# EasyEDA Pro project ProProject_底板_V1_2024-08-05.epro

# Schematic Schematic1
Create Date: 2024-07-20; Page Name: P1; Project Name: 底板_V1; Schematic Name: Schematic1; Update Date: 2024-07-25; Company: 嘉立创EDA; Page Size: A4; Version: V1.0
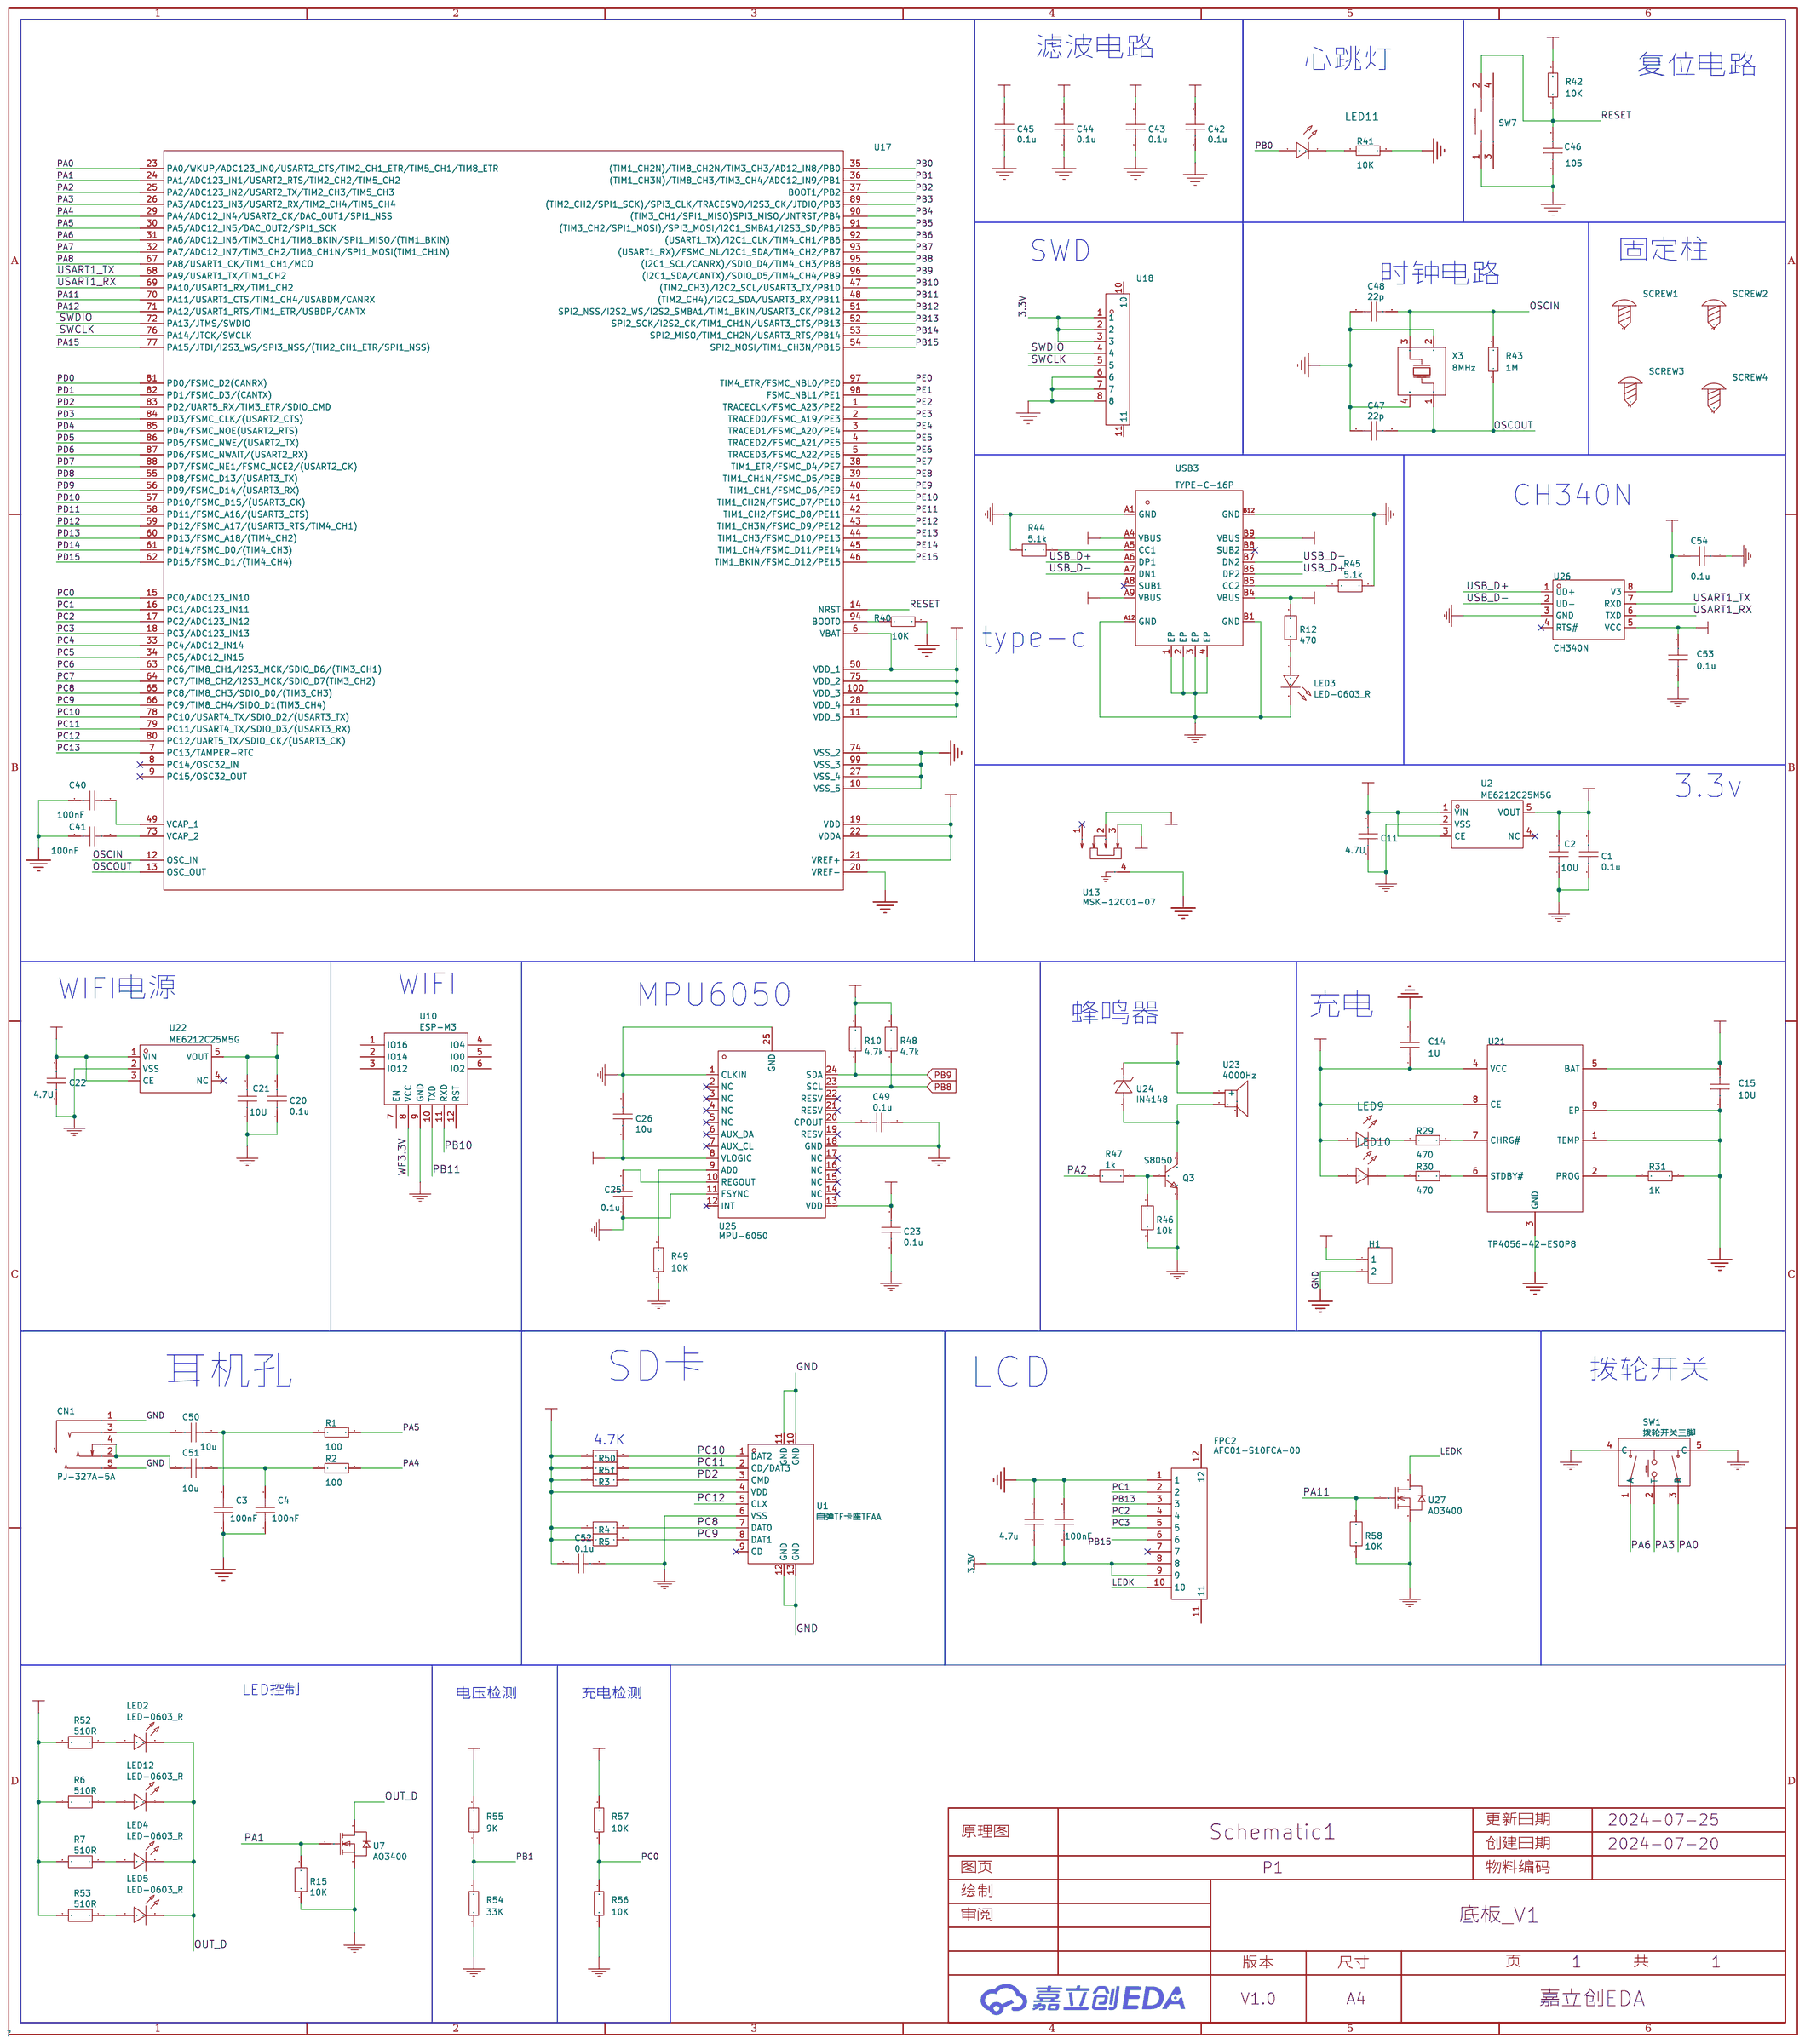
[diagram p0: schematic sheet]

## Parts
C1  0.1u  [footprint_d063]
C2  10U  [footprint_d063]
C3  100nF  [C0603]
C4  100nF  [C0603]
C11  4.7U  [footprint_d063]
C14  1U  [C0603]
C15  10U  [C0603]
C20  0.1u  [footprint_d063]
C21  10U  [footprint_d063]
C22  4.7U  [footprint_d063]
C23  0.1u  [footprint_d063]
C25  0.1u  [footprint_d063]
C26  10u  [footprint_d063]
C40  100nF  [C0603]
C41  100nF  [C0603]
C42  0.1u  [footprint_88df]
C43  0.1u  [footprint_88df]
C44  0.1u  [footprint_88df]
C45  0.1u  [footprint_88df]
C46  105  [footprint_88df]
C47  22p  [footprint_88df]
C48  22p  [footprint_88df]
C49  0.1u  [footprint_d063]
C50  10u  [C0603]
C51  10u  [C0603]
C52  0.1u  [C0603]
C53  0.1u  [footprint_d063]
C54  0.1u  [footprint_d063]
C57  100nF  [C0603]
C58  4.7u  [C0603]
CN1  PJ-327A-5A  [AUDIO-SMD_PJ-327A-5A]
FPC2  AFC01-S10FCA-00  [FPC-SMD_P0.5-10P_FGS-XJ-H2.0]
H1  -  [HDR-TH_2P-P2.54-V-F]
LED2  LED-0603_R  [footprint_5b50]
LED3  LED-0603_R  [footprint_1210]
LED4  LED-0603_R  [footprint_5b50]
LED5  LED-0603_R  [footprint_5b50]
LED9  -  [LED_0603]
LED10  -  [LED_0603]
LED11  -  [LED_0603]
LED12  LED-0603_R  [footprint_5b50]
Q3  S8050  [footprint_2907]
R1  100  [R0603]
R2  100  [R0603]
R3  1k  [R0805]
R4  1k  [R0805]
R5  1k  [R0805]
R6  510R  [footprint_4dfc]
R7  510R  [footprint_4dfc]
R10  4.7k  [footprint_1dde]
R12  470  [footprint_1dde]
R15  10K  [footprint_4dfc]
R29  470  [R0805]
R30  470  [R0805]
R31  1K  [R0805]
R40  10K  [R0603]
R41  10K  [R0603]
R42  10K  [R0603]
R43  1M  [R0603]
R44  5.1k  [footprint_1dde]
R45  5.1k  [footprint_1dde]
R46  10k  [footprint_b185]
R47  1k  [footprint_b185]
R48  4.7k  [footprint_1dde]
R49  10K  [R0603]
R50  1k  [R0805]
R51  1k  [R0805]
R52  510R  [footprint_4dfc]
R53  510R  [footprint_4dfc]
R54  33K  [R0805]
R55  9K  [R0805]
R56  10K  [R0805]
R57  10K  [R0805]
R58  10K  [footprint_4dfc]
SCREW1  -  [M3螺丝]
SCREW2  -  [M3螺丝]
SCREW3  -  [M3螺丝]
SCREW4  -  [M3螺丝]
SW1  拨轮开关三脚  [footprint_864c]
SW7  K2-1806SA-C4DW-04  [footprint_8ca7]
U1  自弹TF卡座TFAA  [SIM-SMD_C9900015645]
U2  ME6212C25M5G  [footprint_203e]
U7  AO3400  [footprint_8e82]
U10  ESP-M3  [footprint_c8ca]
U13  MSK-12C01-07  [SW-SMD_MSK12CO2-BDM]
U17  -  [LQFP-100_L14.0-W14.0-P0.50-LS16.0-BL]
U18  SMTFPC连接器0.5MM间距翻盖8PIN  [FPC-SMD_AFC01-S08FCC-00]
U21  TP4056-42-ESOP8  [ESOP-8_L4.9-W3.9-P1.27-LS6.0-BL-EP]
U22  ME6212C25M5G  [footprint_203e]
U23  4000Hz  [footprint_ea09]
U24  IN4148  [footprint_0926]
U25  MPU-6050  [QFN-24_L4.0-W4.0-P0.50-BL-EP2.7]
U26  CH340N  [SOP-8_L4.9-W3.9-P1.27-LS6.0-BL]
U27  AO3400  [footprint_8e82]
USB3  TYPE-C-16P  [footprint_feef]
X3  8MHz  [OSC-SMD_4P-L3.2-W2.5-BL]

## Library data of the parts
C1 C20 C23 C25 C49 C52-C54 = 0.1u
C2 C21 = 10U
C3 C4 C14 C15 C40 C41 C50 C51 C57 C58 = CAP_0603: Supplier Footprint: 0603
C11 C22 = 4.7U
C26 = 10u
C42-C45 = 1u
C46 = 105
C47 C48 = 22p
CN1 = PJ-327A-5A_C707227: 连接器类型:3.5mm耳机座;额定电流:500mA;额定电压:30V;工作温度范围:-40℃~+80℃;; LCSC Part Name: 3.5mm耳机座; Supplier Part: C707227; Manufacturer: 韩国韩荣; Supplier Footprint: SMD; JLCPCB Part Class: 扩展库; Datasheet: https://atta.szlcsc.com/upload/public/pdf/source/20200721/C707227_9267E4556273F941C560011EDEE7F466.pdf; Supplier: LCSC; Connector Type: 3.5mm耳机座; Current Rating (Max): 500mA; Voltage Rating (Max): 30V; Operating Temperature Range: -40℃~+80℃
FPC2 = AFC01-S10FCA-00: 锁定特性:翻盖式;触点类型:下接;触点数量:10P;间距:0.5mm;安装类型:卧贴;; LCSC Part Name: 间距:0.5mm P数:10P 翻盖式 下接; Supplier Part: C262659; Manufacturer: JS(钜硕电子); Supplier Footprint: SMD,P=0.5mm,卧贴; JLCPCB Part Class: 扩展库; Datasheet: https://atta.szlcsc.com/upload/public/pdf/source/20190816/C413942_2A72D1AC756EAE17EEDF756A339D4500.pdf; Supplier: LCSC; Locking Feature: 翻盖式; Contact Type: 下接; Number of Contacts: 10P; Pitch: 0.5mm; Mounting Type: 卧贴; FFC, FCB Thickness: 0.3mm; Height Above Board: 2mm
H1 = HDR-F_2.54_1x2P: Supplier Part: C49661; Supplier Footprint: 插件
LED2-LED5 LED12 = LED-0603_R: Manufacturer: EVERLIGHT(台湾亿光); Manufacturer Part: 19-217/R6C-AL1M2VY/3T; Supplier Part: C72044; Supplier: LCSC
LED9-LED11 = LED_0603-R: Supplier Footprint: 0603
Q3 = S8050: Supplier: LCSC; Supplier Part: C2984677; Manufacturer: 集晶电子; JLCPCB Part Class: Extended Part; link: https://so.szlcsc.com/global.html?k=C2984677&amp;ref=editor
R1 R2 R40-R43 R49 = Res_0603: Supplier Footprint: 0603
R3-R5 R47 R50 R51 = 1k
R6 R7 R52 R53 = 510R
R10 R48 = 4.7k
R12 = 470
R15 R58 = 10K
R29-R31 R54-R57 = Res_0805: Supplier Footprint: 0805
R44 R45 = 5.1k
R46 = 00k
SCREW1-SCREW4 = M3螺丝: Supplier Footprint: 插件
SW1 = 拨轮开关三脚
SW7 = K2-1806SA-C4DW-04: Supplier: LCSC; Supplier Part: C961746; Manufacturer: 韩国韩荣; JLCPCB Part Class: Extended Part
U1 = 自弹TF卡座TFAA: Supplier: LCSC; Supplier Part: C9900015645; Manufacturer: null; link: https://atta.szlcsc.comnull; JLCPCB Part Class: Extended Part
U2 U22 = ME6212C25M5G: Supplier: LCSC; Supplier Part: C2911282; Manufacturer: MICRONE(南京微盟); JLCPCB Part Class: Extended Part; link: https://so.szlcsc.com/global.html?k=C2911282&amp;ref=editor
U7 U27 = AO3400: Supplier: LCSC; Supplier Part: C5224189; Manufacturer: ElecSuper(静芯微）; JLCPCB Part Class: Extended Part; link: https://so.szlcsc.com/global.html?k=C5224189&amp;ref=editor
U10 = ESP-M3
U13 = MSK-12C01-07: Supplier: LCSC; Supplier Part: C9900005167; Manufacturer: null; JLCPCB Part Class: Extended Part
U17 = STM32F407VET6: tags: STM32; Supplier Part: C28730; Supplier: LCSC; Manufacturer: ST; image: http://image.lceda.cn/szlcsc/C28730.jpg; JLCPCB Part Class: Basic
U18 = SMTFPC连接器0.5MM间距翻盖8PIN: Supplier Part: C9900001730; JLCPCB Part Class: Extended Part; Datasheet: 2021-11-11/570927A/0f6bb2f581574a4697c3d67af550caf2/10301099.pdf; Supplier: LCSC
U21 = TP4056: 充电电池的类型:-;电池单元组数:-;最大充电电流:-;充满的电池组电压:-;最大供应电压:-;; Supplier Part: C16581; Manufacturer: TOPPOWER(南京拓微); Supplier Footprint: ESOP-8; JLCPCB Part Class: Basic Part; Datasheet: https://atta.szlcsc.com/upload/public/pdf/source/20190626/C16581_611BCF5D7CF554EAE465137A8F68DB3E.pdf; Supplier: LCSC
U23 = 4000Hz: Supplier: LCSC; Supplier Part: C781883; Manufacturer: YUEXIN(悦馨); Manufacturer Part: YX-SMD5020; JLCPCB Part Class: Extended Part
U24 = IN4148: Supplier: LCSC; Supplier Part: C9900004332; Manufacturer: null; Manufacturer Part: IN4148贴片二极管; JLCPCB Part Class: Extended Part; link: https://so.szlcsc.com/global.html?k=C9900004332&amp;ref=editor
U25 = MPU-6050_C24112: 三轴加速度计和三轴陀螺仪，工作电压：2.375V~3.46V; Supplier Part: C24112; Manufacturer: TDK InvenSense(应美盛); Supplier Footprint: QFN-24(4x4); JLCPCB Part Class: Basic Part; Datasheet: https://atta.szlcsc.com/upload/public/pdf/source/20140425/1457707046159.pdf; Supplier: LCSC
U26 = CH340N: LCSC Part Name: USB转串口芯片 CH340; Supplier Part: C2977777; Manufacturer: WCH(南京沁恒); Supplier Footprint: SOP-8; JLCPCB Part Class: 扩展库; Datasheet: https://atta.szlcsc.com/upload/public/pdf/source/20230530/6E401E9554E9F5311886CC8B3F89B62E.pdf; Supplier: LCSC
USB3 = TYPE-C-16P: Supplier: LCSC; Supplier Part: C709357; Manufacturer: Shenzhen Kinghelm Elec; Manufacturer Part: KH-TYPE-C-16P; JLCPCB Part Class: Extended Part
X3 = X322525MOB4SI: 晶振类型:贴片无源晶振;频率:25MHz;频率公差:±10ppm;频率稳定度:±30ppm;负载电容:12pF;工作温度:-40℃~+85℃;; LCSC Part Name: 25MHz ±10ppm 12pF; Supplier Part: C9006; Manufacturer: YXC(扬兴晶振); Supplier Footprint: SMD3225-4P; JLCPCB Part Class: Basic Part; Datasheet: https://atta.szlcsc.com/upload/public/pdf/source/20210329/C112971_1F611BDC486E193C1706F6D8EB5AA189.pdf; Supplier: LCSC; Crystal Type: 贴片无源晶振; Frequency Tolerance: ±10ppm; Frequency Stability: ±30ppm; Load Capacitance: 12pF; Operating Temperature: -40℃~+85℃

## Nets
3.3V: C1.2 C2.2 C23.2 C26.2 C42.2 C43.2 C44.2 C45.2 C52.1 C53.2 C54.2 C57.1 C58.1 FPC2.8 FPC2.9 R3.1 R4.1 R5.1 R6.2 R7.2 R10.2 R42.2 R48.2 R50.1 R51.1 R52.2 R53.2 U1.4(VDD) U2.5(VOUT) U17.6(VBAT) U17.11(VDD_5) U17.19(VDD) U17.21(VREF+) U17.22(VDDA) U17.28(VDD_4) U17.50(VDD_1) U17.75(VDD_2) U17.100(VDD_3) U18.1 U18.2 U18.3 U23.1(+) U24.1(K) U25.8(VLOGIC) U25.13(VDD) U26.5(VCC) U26.8(V3)
3.7V: C11.2 C22.2 R55.2 U2.1(VIN) U2.3(CE) U13.2 U22.1(VIN) U22.3(CE)
5V: C14.1 LED9.2(A) LED10.2(A) R12.2 R57.2 U21.4(VCC) U21.8(CE) USB3.A4(VBUS) USB3.A9(VBUS) USB3.B4(VBUS) USB3.B9(VBUS)
GND: C1.1 C2.1 C3.1 C4.1 C11.1 C14.2 C15.1 C20.1 C21.1 C22.1 C23.1 C25.1 C26.1 C40.1 C41.1 C42.1 C43.1 C44.1 C45.1 C46.1 C47.1 C48.1 C49.2 C52.2 C53.1 C54.1 C57.2 C58.2 CN1.1 CN1.5 FPC2.1 H1.2 LED3.2 Q3.2(E) R15.1 R31.2 R40.2 R41.2 R44.1 R45.2 R46.1 R49.1 R54.1 R56.1 R58.1 SW1.4(C) SW1.5(C) SW7.1 U1.6(VSS) U1.10(GND) U1.11(GND) U1.12(GND) U1.13(GND) U2.2(VSS) U7.2(S) U10.9(GND) U13.4 U17.10(VSS_5) U17.20(VREF-) U17.27(VSS_4) U17.74(VSS_2) U17.99(VSS_3) U18.6 U18.7 U18.8 U21.1(TEMP) U21.3(GND) U21.9(EP) U22.2(VSS) U25.1(CLKIN) U25.11(FSYNC) U25.18(GND) U25.25(GND) U26.3(GND) U27.2(S) USB3.1(EP) USB3.2(EP) USB3.3(EP) USB3.4(EP) USB3.A1(GND) USB3.A12(GND) USB3.B1(GND) USB3.B12(GND) X3.2(GND) X3.4(GND)
VIN: C15.2 H1.1 U13.3 U21.5(BAT)
LEDK: FPC2.10 U27.3(D)
OSCIN: C48.2 R43.2 U17.12(OSC_IN) X3.3(OSC2)
OSCOUT: C47.2 R43.1 U17.13(OSC_OUT) X3.1(OSC1)
OUT_D: LED2.2 LED4.2 LED5.2 LED12.2 U7.3(D)
PA0: SW1.3(B) U17.23(PA0/WKUP/ADC123_IN0/USART2_CTS/TIM2_CH1_ETR/TIM5_CH1/TIM8_ETR)
PA1: R15.2 U7.1(G) U17.24(PA1/ADC123_IN1/USART2_RTS/TIM2_CH2/TIM5_CH2)
PA2: R47.1 U17.25(PA2/ADC123_IN2/USART2_TX/TIM2_CH3/TIM5_CH3)
PA3: SW1.2(T) U17.26(PA3/ADC123_IN3/USART2_RX/TIM2_CH4/TIM5_CH4)
PA4: R2.2 U17.29(PA4/ADC12_IN4/USART2_CK/DAC_OUT1/SPI1_NSS)
PA5: R1.2 U17.30(PA5/ADC12_IN5/DAC_OUT2/SPI1_SCK)
PA6: SW1.1(A) U17.31(PA6/ADC12_IN6/TIM3_CH1/TIM8_BKIN/SPI1_MISO/(TIM1_BKIN))
PA7: U17.32(PA7/ADC12_IN7/TIM3_CH2/TIM8_CH1N/SPI1_MOSI(TIM1_CH1N))
PA8: U17.67(PA8/USART1_CK/TIM1_CH1/MCO)
PA11: R58.2 U17.70(PA11/USART1_CTS/TIM1_CH4/USABDM/CANRX) U27.1(G)
PA12: U17.71(PA12/USART1_RTS/TIM1_ETR/USBDP/CANTX)
PA15: U17.77(PA15/JTDI/I2S3_WS/SPI3_NSS/(TIM2_CH1_ETR/SPI1_NSS))
PB0: LED11.2(A) U17.35((TIM1_CH2N)/TIM8_CH2N/TIM3_CH3/AD12_IN8/PB0)
PB1: R54.2 R55.1 U17.36((TIM1_CH3N)/TIM8_CH3/TIM3_CH4/ADC12_IN9/PB1)
PB2: U17.37(BOOT1/PB2)
PB3: U17.89((TIM2_CH2/SPI1_SCK)/SPI3_CLK/TRACESWO/I2S3_CK/JTDIO/PB3)
PB4: U17.90((TIM3_CH1/SPI1_MISO)SPI3_MISO/JNTRST/PB4)
PB5: U17.91((TIM3_CH2/SPI1_MOSI)/SPI3_MOSI/I2C1_SMBA1/I2S3_SD/PB5)
PB6: U17.92((USART1_TX)/I2C1_CLK/TIM4_CH1/PB6)
PB7: U17.93((USART1_RX)/FSMC_NL/I2C1_SDA/TIM4_CH2/PB7)
PB8: R48.1 U17.95((I2C1_SCL/CANRX)/SDIO_D4/TIM4_CH3/PB8) U25.23(SCL)
PB9: R10.1 U17.96((I2C1_SDA/CANTX)/SDIO_D5/TIM4_CH4/PB9) U25.24(SDA)
PB10: U10.11(RXD) U17.47((TIM2_CH3)/I2C2_SCL/USART3_TX/PB10)
PB11: U10.10(TXD) U17.48((TIM2_CH4)/I2C2_SDA/USART3_RX/PB11)
PB12: U17.51(SPI2_NSS/I2S2_WS/I2S2_SMBA1/TIM1_BKIN/USART3_CK/PB12)
PB13: FPC2.3 U17.52(SPI2_SCK/I2S2_CK/TIM1_CH1N/USART3_CTS/PB13)
PB14: U17.53(SPI2_MISO/TIM1_CH2N/USART3_RTS/PB14)
PB15: FPC2.6 U17.54(SPI2_MOSI/TIM1_CH3N/PB15)
PC0: R56.2 R57.1 U17.15(PC0/ADC123_IN10)
PC1: FPC2.2 U17.16(PC1/ADC123_IN11)
PC2: FPC2.4 U17.17(PC2/ADC123_IN12)
PC3: FPC2.5 U17.18(PC3/ADC123_IN13)
PC4: U17.33(PC4/ADC12_IN14)
PC5: U17.34(PC5/ADC12_IN15)
PC6: U17.63(PC6/TIM8_CH1/I2S3_MCK/SDIO_D6/(TIM3_CH1))
PC7: U17.64(PC7/TIM8_CH2/I2S3_MCK/SDIO_D7(TIM3_CH2))
PC8: R4.2 U1.7(DAT0) U17.65(PC8/TIM8_CH3/SDIO_D0/(TIM3_CH3))
PC9: R5.2 U1.8(DAT1) U17.66(PC9/TIM8_CH4/SIDO_D1(TIM3_CH4))
PC10: R50.2 U1.1(DAT2) U17.78(PC10/USART4_TX/SDIO_D2/(USART3_TX))
PC11: R51.2 U1.2(CD/DAT3) U17.79(PC11/USART4_TX/SDIO_D3/(USART3_RX))
PC12: U1.5(CLX) U17.80(PC12/UART5_TX/SDIO_CK/(USART3_CK))
PC13: U17.7(PC13/TAMPER-RTC)
PD0: U17.81(PD0/FSMC_D2(CANRX))
PD1: U17.82(PD1/FSMC_D3/(CANTX))
PD2: R3.2 U1.3(CMD) U17.83(PD2/UART5_RX/TIM3_ETR/SDIO_CMD)
PD3: U17.84(PD3/FSMC_CLK/(USART2_CTS))
PD4: U17.85(PD4/FSMC_NOE(USART2_RTS))
PD5: U17.86(PD5/FSMC_NWE/(USART2_TX))
PD6: U17.87(PD6/FSMC_NWAIT/(USART2_RX))
PD7: U17.88(PD7/FSMC_NE1/FSMC_NCE2/(USART2_CK))
PD8: U17.55(PD8/FSMC_D13/(USART3_TX))
PD9: U17.56(PD9/FSMC_D14/(USART3_RX))
PD10: U17.57(PD10/FSMC_D15/(USART3_CK))
PD11: U17.58(PD11/FSMC_A16/(USART3_CTS))
PD12: U17.59(PD12/FSMC_A17/(USART3_RTS/TIM4_CH1))
PD13: U17.60(PD13/FSMC_A18/(TIM4_CH2))
PD14: U17.61(PD14/FSMC_D0/(TIM4_CH3))
PD15: U17.62(PD15/FSMC_D1/(TIM4_CH4))
PE0: U17.97(TIM4_ETR/FSMC_NBL0/PE0)
PE1: U17.98(FSMC_NBL1/PE1)
PE2: U17.1(TRACECLK/FSMC_A23/PE2)
PE3: U17.2(TRACED0/FSMC_A19/PE3)
PE4: U17.3(TRACED1/FSMC_A20/PE4)
PE5: U17.4(TRACED2/FSMC_A21/PE5)
PE6: U17.5(TRACED3/FSMC_A22/PE6)
PE7: U17.38(TIM1_ETR/FSMC_D4/PE7)
PE8: U17.39(TIM1_CH1N/FSMC_D5/PE8)
PE9: U17.40(TIM1_CH1/FSMC_D6/PE9)
PE10: U17.41(TIM1_CH2N/FSMC_D7/PE10)
PE11: U17.42(TIM1_CH2/FSMC_D8/PE11)
PE12: U17.43(TIM1_CH3N/FSMC_D9/PE12)
PE13: U17.44(TIM1_CH3/FSMC_D10/PE13)
PE14: U17.45(TIM1_CH4/FSMC_D11/PE14)
PE15: U17.46(TIM1_BKIN/FSMC_D12/PE15)
RESET: C46.2 R42.1 SW7.2 U17.14(NRST)
SWCLK: U17.76(PA14/JTCK/SWCLK) U18.5
SWDIO: U17.72(PA13/JTMS/SWDIO) U18.4
USART1_RX: U17.69(PA10/USART1_RX/TIM1_CH2) U26.6(TXD)
USART1_TX: U17.68(PA9/USART1_TX/TIM1_CH2) U26.7(RXD)
USB_D+: U26.1(UD+) USB3.A6(DP1) USB3.B6(DP2)
USB_D-: U26.2(UD-) USB3.A7(DN1) USB3.B7(DN2)
WF3.3V: C20.2 C21.2 U10.8(VCC) U22.5(VOUT)
$1N8081: R40.1 U17.94(BOOT0)
$1N8083: C40.2 U17.49(VCAP_1)
$1N8084: C41.2 U17.73(VCAP_2)
$1N8487: LED11.1(C) R41.1
$1N9627: R45.1 USB3.B5(CC2)
$1N9629: R44.2 USB3.A5(CC1)
$1N11460: LED3.1 R12.1
$1N11750: R29.2 U21.7(CHRG#)
$1N11751: R30.2 U21.6(STDBY#)
$1N11752: LED9.1(C) R29.1
$1N11753: LED10.1(C) R30.1
$1N11757: R31.1 U21.2(PROG)
$1N13842: Q3.3(C) U23.2(-) U24.2(A)
$1N13844: Q3.1(B) R46.2 R47.2
$1N14203: C49.1 U25.20(CPOUT)
$1N14204: C25.2 U25.10(REGOUT)
$1N14208: R49.2 U25.9(AD0)
$1N15753: C50.1 CN1.3
$1N15754: C51.1 CN1.2 CN1.4
$1N15756: C3.2 C50.2 R1.1
$1N15757: C4.2 C51.2 R2.1
$1N16357: LED2.1 R52.1
$1N16358: LED12.1 R6.1
$1N16359: LED4.1 R7.1
$1N16360: LED5.1 R53.1

Not connected (* = marked no-connect by the designer): FPC2 7* 11 12; SCREW1 1; SCREW2 1; SCREW3 1; SCREW4 1; SW7 3 4; U1 9(CD)*; U2 4(NC)*; U10 1(IO16) 2(IO14) 3(IO12) 4(IO4) 5(IO0) 6(IO2) 7(EN) 12(RST); U13 1*; U17 8(PC14/OSC32_IN)* 9(PC15/OSC32_OUT)*; U18 10 11; U22 4(NC)*; U23 3(NC); U25 2(NC)* 3(NC)* 4(NC)* 5(NC)* 6(AUX_DA)* 7(AUX_CL)* 12(INT)* 14(NC)* 15(NC)* 16(NC)* 17(NC)* 19(RESV)* 21(RESV)* 22(RESV)*; U26 4(RTS#)*; USB3 A8(SUB1)* B8(SUB2)*

## Notes on the sheet
- 滤波电路
- 心跳灯
- 复位电路
- SWD
- 固定柱
- 时钟电路
- CH340N
- type-c
- 3.3v
- WIFI
- WIFI电源
- MPU6050
- 蜂鸣器
- 充电
- 耳机孔
- SD卡
- LCD
- 拨轮开关
- 4.7K
- LED控制
- 电压检测
- 充电检测

# Board PCB1
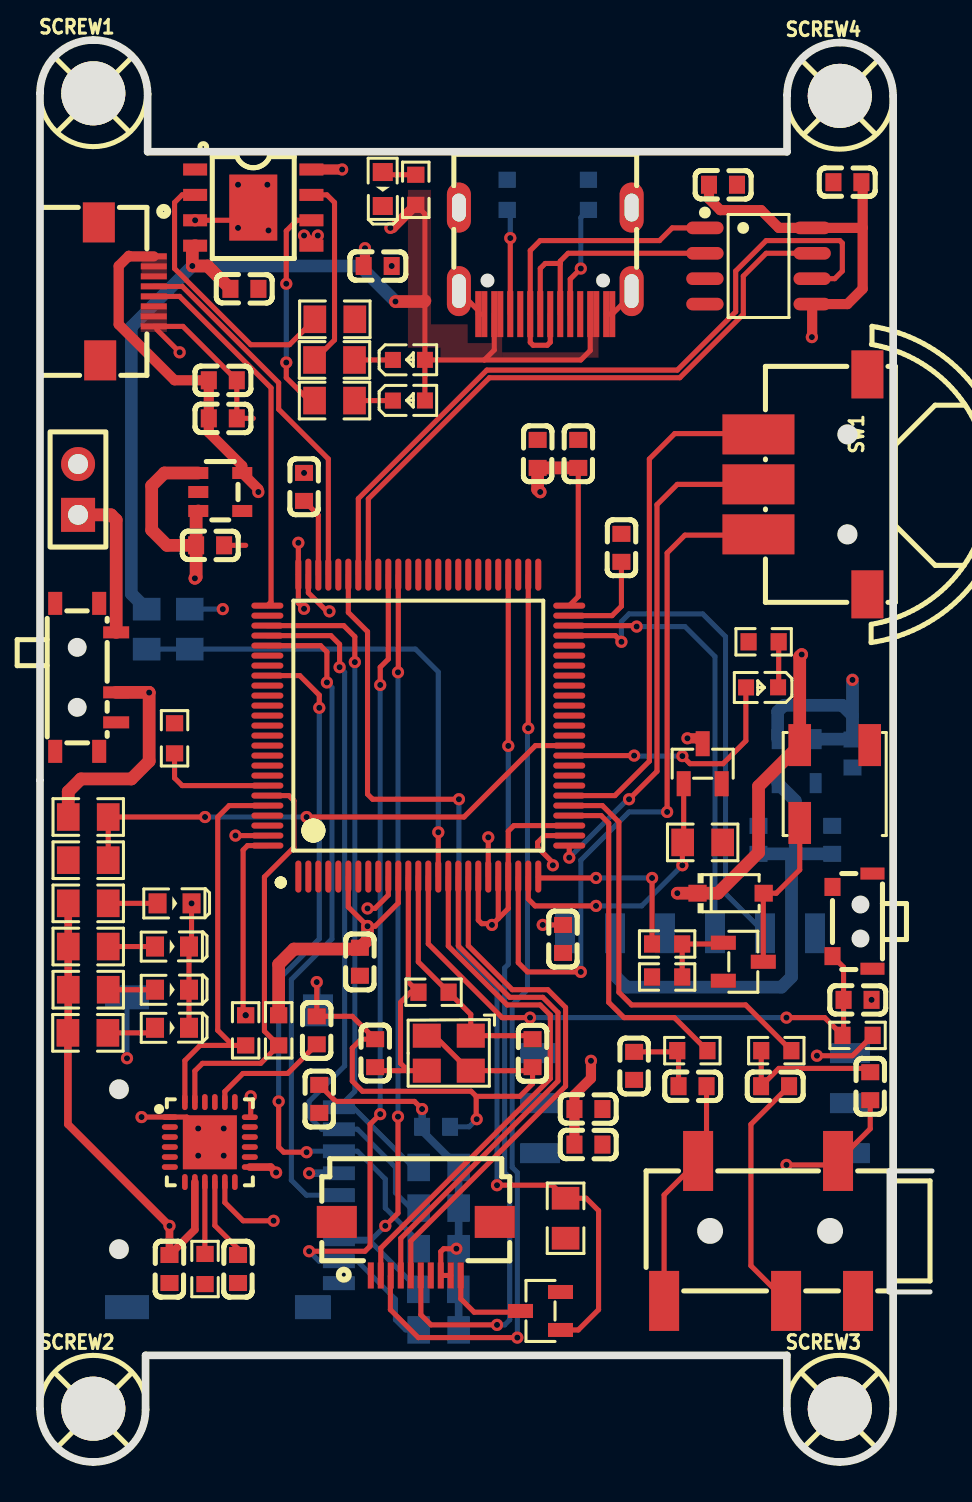
[diagram p1: board, top side]
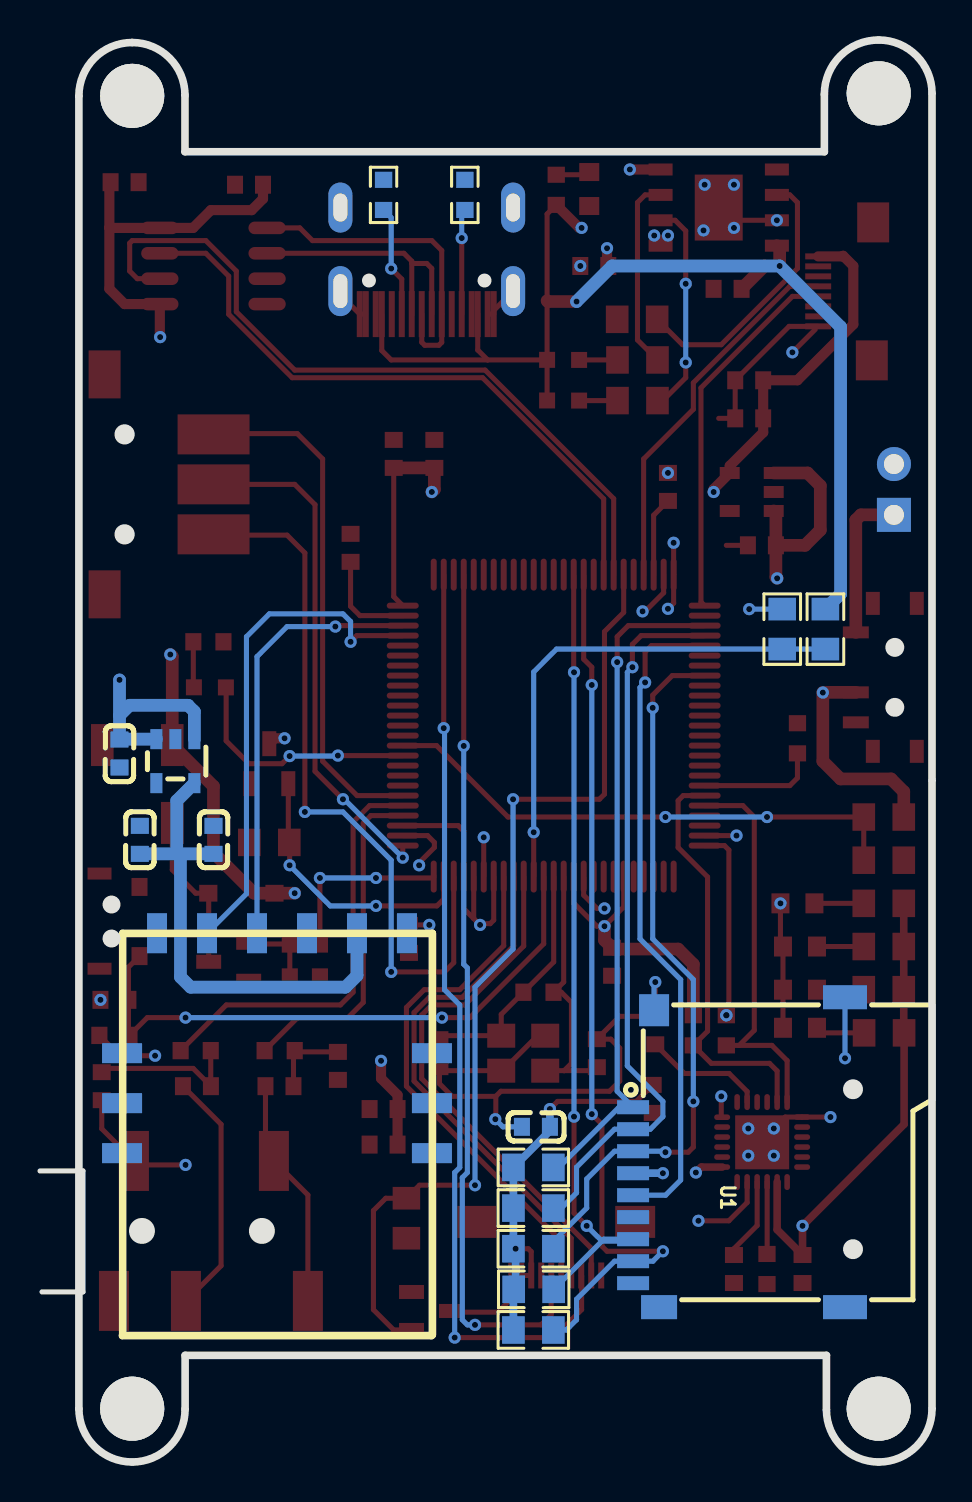
[diagram p2: board, bottom side, seen from below]

Outline 44.62 x 71.12 mm; copper layers: Top Layer, Inner1, Inner2, Bottom Layer. Coordinates in mm from the lower left corner of the outline.
Outline path: 0,68.45 arc(0.78,70.34) 2.67,71.12 arc(4.59,70.32) 5.38,68.4 5.38,65.53 37.37,65.53 37.37,68.35 arc(38.14,70.22) 40,70.99 arc(41.89,70.21) 42.67,68.33 42.67,2.67 arc(41.89,0.78) 40,0 arc(38.13,0.77) 37.36,2.65 37.36,5.33 5.28,5.33 5.28,2.61 arc(4.52,0.77) 2.67,0 arc(0.78,0.78) 0,2.67 0,68.45
Stack: Top Layer 0.035mm 外层铜厚1oz / Dielectric1 0.2104mm 7628 RC49% 8.6mil / Inner1 0.0152mm 内层铜厚 / Dielectric2 1.065mm 1.1mm H/HOZ 含铜 / Inner2 0.0152mm 内层铜厚 / Dielectric3 0.2104mm 7628 RC49% 8.6mil / Bottom Layer 0.035mm 外层铜厚1oz

## Design rules (mm)
template: JLCPCB Capability(Two Layers Board)
spacing copperThickness1oz (default): track to track 0.102, other pairs 0.152 to 0.3
spacing copperThickness2oz: track to track 0.203, other pairs 0.152 to 0.3
track width copperThickness1oz (default): min 0.127, default 0.254, max 2.54
track width copperThickness2oz: min 0.203, default 0.254, max 2.54
differential pair differentialPair (default): width min 0.127, default 0.254, max 2.54; gap min 0.152, default 0.152
via viaSize (default): diameter min 0.5, default 0.61, max 10; hole min 0.3, default 0.305, max 6.3

## Placement (name value [footprint] x y rotation side)
C1  0.1u  [footprint_d063]  9.14 52.2 180 top
C2  10U  [footprint_d063]  9.14 54.1 180 top
C3  100nF  [C0603]  41.53 18.8 90 top
C4  100nF  [C0603]  29.72 19.81 90 top
C11  4.7U  [footprint_d063]  8.51 45.85 180 top
C14  1U  [C0603]  10.22 58.67 0 top
C15  10U  [C0603]  16.89 59.82 180 top
C20  0.1u  [footprint_d063]  35.94 31.12 270 bottom
C21  10U  [footprint_d063]  39.62 31.12 270 bottom
C22  4.7U  [footprint_d063]  40.64 35.43 90 bottom
C23  0.1u  [footprint_d063]  13.97 18.16 90 top
C25  0.1u  [footprint_d063]  9.91 9.65 90 top
C26  10u  [footprint_d063]  6.48 9.65 90 top
C40  100nF  [C0603]  29.08 45.72 270 top
C41  100nF  [C0603]  13.21 48.77 270 top
C42  0.1u  [footprint_88df]  26.92 50.42 270 top
C43  0.1u  [footprint_88df]  26.16 26.16 90 top
C44  0.1u  [footprint_88df]  16 25.02 90 top
C45  0.1u  [footprint_88df]  24.89 50.42 270 top
C46  105  [footprint_88df]  40.89 23.11 180 top
C47  22p  [footprint_88df]  24.64 20.45 90 top
C48  22p  [footprint_88df]  16.76 20.45 270 top
C49  0.1u  [footprint_d063]  13.84 21.59 90 top
C50  10u  [C0603]  36.77 18.8 180 top
C51  10u  [C0603]  32.64 18.8 180 top
C52  0.1u  [C0603]  19.81 16.76 0 bottom
C53  0.1u  [footprint_d063]  40.39 64.01 0 top
C54  0.1u  [footprint_d063]  34.16 63.88 180 top
C57  100nF  [C0603]  27.43 17.65 0 top
C58  4.7u  [C0603]  27.43 15.88 0 top
CN1  PJ-327A-5A  [AUDIO-SMD_PJ-327A-5A]  36.07 11.56 180 top
FPC2  AFC01-S10FCA-00  [FPC-SMD_P0.5-10P_FGS-XJ-H2.0]  18.8 10.67 0 top
H1  -  [HDR-TH_2P-P2.54-V-F]  1.91 48.64 90 top
LED2  LED-0603_R  [footprint_5b50]  6.6 23.62 0 top
LED3  LED-0603_R  [footprint_1210]  17.15 63.67 270 top
LED4  LED-0603_R  [footprint_5b50]  6.73 27.94 0 top
LED5  LED-0603_R  [footprint_5b50]  6.6 25.78 0 top
LED9  -  [LED_0603]  18.5 55.13 0 top
LED10  -  [LED_0603]  18.5 53.1 0 top
LED11  -  [LED_0603]  36.07 38.73 180 top
LED12  LED-0603_R  [footprint_5b50]  6.6 21.72 0 top
Q3  S8050  [footprint_2907]  35.18 25.02 180 top
R1  100  [R0603]  36.83 20.57 0 top
R2  100  [R0603]  32.63 20.57 0 top
R3  1k  [R0805]  19.94 10.67 180 bottom
R4  1k  [R0805]  19.92 8.64 180 bottom
R5  1k  [R0805]  19.94 6.6 180 bottom
R6  510R  [footprint_4dfc]  2.4 21.46 180 top
R7  510R  [footprint_4dfc]  2.41 27.94 180 top
R10  4.7k  [footprint_1dde]  10.29 21.59 90 top
R12  470  [footprint_1dde]  18.8 63.63 270 top
R15  10K  [footprint_4dfc]  33.15 30.99 180 top
R29  470  [R0805]  14.73 55.12 180 top
R30  470  [R0805]  14.73 53.09 180 top
R31  1K  [R0805]  14.75 57.15 0 top
R40  10K  [R0603]  6.73 36.2 90 top
R41  10K  [R0603]  36.19 41.02 180 top
R42  10K  [R0603]  40.89 21.34 0 top
R43  1M  [R0603]  19.69 23.5 180 top
R44  5.1k  [footprint_1dde]  27.43 63.37 270 bottom
R45  5.1k  [footprint_1dde]  23.37 63.37 90 bottom
R46  10k  [footprint_b185]  31.37 24.26 0 top
R47  1k  [footprint_b185]  31.37 25.91 0 top
R48  4.7k  [footprint_1dde]  11.94 21.59 90 top
R49  10K  [R0603]  8.25 9.65 90 top
R50  1k  [R0805]  19.94 14.73 180 bottom
R51  1k  [R0805]  19.94 12.7 180 bottom
R52  510R  [footprint_4dfc]  2.41 23.62 180 top
R53  510R  [footprint_4dfc]  2.41 25.78 180 top
R54  33K  [R0805]  2.41 30.1 0 top
R55  9K  [R0805]  2.41 32.26 180 top
R56  10K  [R0805]  7.49 41.66 270 bottom
R57  10K  [R0805]  5.33 41.66 90 bottom
R58  10K  [footprint_4dfc]  26.29 12.19 90 top
SCREW1  -  [M3螺丝]  2.73 68.39 0 top
SCREW2  -  [M3螺丝]  2.73 2.6 0 top
SCREW3  -  [M3螺丝]  40.07 2.6 0 top
SCREW4  -  [M3螺丝]  40.07 68.26 0 top
SW1  拨轮开关三脚  [footprint_864c]  40.39 48.9 270 top
SW7  K2-1806SA-C4DW-04  [footprint_8ca7]  40.64 27.05 270 top
U1  自弹TF卡座TFAA  [SIM-SMD_C9900015645]  9.65 15.49 90 bottom
U2  ME6212C25M5G  [footprint_203e]  9.02 48.51 270 top
U7  AO3400  [footprint_8e82]  33.15 34.92 270 top
U10  ESP-M3  [footprint_c8ca]  25.01 15.45 0 bottom
U13  MSK-12C01-07  [SW-SMD_MSK12CO2-BDM]  2.29 39.24 270 top
U17  -  [LQFP-100_L14.0-W14.0-P0.50-LS16.0-BL]  18.92 36.83 0 top
U18  SMTFPC连接器0.5MM间距翻盖8PIN  [FPC-SMD_AFC01-S08FCC-00]  4.32 58.55 270 top
U21  TP4056-42-ESOP8  [ESOP-8_L4.9-W3.9-P1.27-LS6.0-BL-EP]  10.67 62.74 270 top
U22  ME6212C25M5G  [footprint_203e]  37.85 35.05 0 bottom
U23  4000Hz  [footprint_ea09]  39.75 33.91 270 top
U24  IN4148  [footprint_0926]  34.54 28.45 0 top
U25  MPU-6050  [QFN-24_L4.0-W4.0-P0.50-BL-EP2.7]  8.5 16 270 top
U26  CH340N  [SOP-8_L4.9-W3.9-P1.27-LS6.0-BL]  35.94 59.82 270 top
U27  AO3400  [footprint_8e82]  25.03 7.55 0 top
USB3  TYPE-C-16P  [footprint_feef]  25.27 60.33 180 top
X3  8MHz  [OSC-SMD_4P-L3.2-W2.5-BL]  20.45 20.45 180 top

## Footprints (pads in the part's own frame, mm; a bottom-side part is the same pattern mirrored in y, then rotated)
AUDIO-SMD_PJ-327A-5A
  rect 1.5x3 smd: 1(-4.85,3.5) 2(3.15,-3.5) 3(-1.25,3.5) 4(4.85,3.5) 5(-3.85,-3.5)
C0603
  rect 0.8x0.9 smd: 1(-0.7,0) 2(0.7,0)
ESOP-8_L4.9-W3.9-P1.27-LS6.0-BL-EP
  rect 0.6x1.2 smd: 1(-1.905,-2.909) 2(-0.635,-2.909) 3(0.635,-2.909) 4(1.905,-2.909) 5(1.905,2.909) 6(0.635,2.909) 7(-0.635,2.909) 8(-1.905,2.909)
  rect 3.3x2.4 smd: 9(0,0)
footprint_1dde
  rect 0.806x0.864 smd: 1(-0.753,0) 2(0.753,0)
footprint_4dfc
  rect 1.133x1.377 smd: 1(-1,0) 2(1,0)
footprint_5b50
  rect 0.9x1 smd: 1(-0.85,0) 2(0.85,0)
footprint_8ca7
  rect 0.9x0.8 smd: 1(-1.71,-1) 2(1.75,-1)
  rect 0.6x1.2 smd: 3(-2.38,1) 4(2.38,1)
footprint_8e82
  rect 1.25x0.7 smd: 1(1,-0.95) 2(1,0.95) 3(-1,0)
footprint_88df
  rect 0.8x0.9 smd: 1(-0.7,0) 2(0.7,0)
footprint_203e
  rect 0.6x1 smd: 1(-0.95,-1.1) 2(0,-1.1) 3(0.95,-1.1) 4(0.95,1.1) 5(-0.95,1.1)
footprint_864c
  rect 2x3.6 smd: 1(-2.5,-4.45) 2(0,-4.45) 3(2.5,-4.45)
  rect 2.4x1.6 smd: 4(-5.5,1) 5(5.5,1)
footprint_0926
  rect 0.91x0.84 smd: 1(-1.655,0) 2(1.655,0)
footprint_1210
  rect 0.9x1 smd: 1(-0.85,0) 2(0.85,0)
footprint_2907
  rect 1.25x0.7 smd: 1(1,-0.95) 2(1,0.95) 3(-1,0)
footprint_b185
  rect 0.806x0.864 smd: 1(-0.753,0) 2(0.753,0)
footprint_c8ca
  rect 2x1 smd: 1(0,0) 2(0,-2.5) 3(0,-5) 4(15.5,0) 5(15.5,-2.5) 6(15.5,-5)
  rect 1x2 smd: 7(1.25,-11) 8(3.75,-11) 9(6.25,-11) 10(8.75,-11) 11(11.25,-11) 12(13.75,-11)
footprint_d063
  rect 0.8x0.9 smd: 1(-0.7,0) 2(0.7,0)
footprint_ea09
  rect 2.1x1.13 smd: 1(-1.948,-1.75) 2(1.948,-1.75) 3(-1.948,1.75)
footprint_feef
  oval 1.2x2.5 hole 0.7x1.7: 1(-4.32,1.765) 2(4.32,1.765)
  oval 1.2x2.5 hole 0.7x1.4: 3(-4.32,-2.415) 4(4.32,-2.415)
  rect 0.3x2.3 smd: A1(-3.35,2.915) A4(-2.55,2.915) A5(-1.25,2.915) A6(-0.25,2.915) A7(0.25,2.915) A8(1.25,2.915) A9(2.55,2.915) A12(3.35,2.915) B1(3.05,2.915) B4(2.25,2.915) B5(1.75,2.915) B6(0.75,2.915) B7(-0.75,2.915) B8(-1.75,2.915) B9(-2.25,2.915) B12(-3.05,2.915)
FPC-SMD_AFC01-S08FCC-00
  rect 0.3x1.3 smd: 1(-1.75,1.375) 2(-1.251,1.375) 3(-0.751,1.375) 4(-0.251,1.375) 5(0.25,1.375) 6(0.75,1.375) 7(1.25,1.375) 8(1.75,1.375)
  rect 2x1.6 smd: 10(-3.45,-1.375) 11(3.45,-1.306)
FPC-SMD_P0.5-10P_FGS-XJ-H2.0
  rect 0.3x1.3 smd: 1(-2.25,-1.339) 2(-1.75,-1.339) 3(-1.25,-1.34) 4(-0.75,-1.339) 5(-0.25,-1.34) 6(0.25,-1.339) 7(0.75,-1.339) 8(1.25,-1.339) 9(1.75,-1.339) 10(2.25,-1.34)
  rect 2x1.6 smd: 11(3.95,1.34) 12(-3.95,1.34)
HDR-TH_2P-P2.54-V-F
  rect 1.7x1.7 hole 1: 1(-1.27,0)
  round 1.7 hole 1: 2(1.27,0)
LED_0603
  rect 0.8x0.8 smd: 1(-0.851,-0.01) 2(0.75,-0.005)
LQFP-100_L14.0-W14.0-P0.50-LS16.0-BL
  oval 0.3x1.6 smd: 1(-6,-7.55) 2(-5.5,-7.55) 3(-5,-7.55) 4(-4.5,-7.55) 5(-4,-7.55) 6(-3.5,-7.55) 7(-3,-7.55) 8(-2.5,-7.55) 9(-2,-7.55) 10(-1.5,-7.55) 11(-1,-7.55) 12(-0.5,-7.55) 13(0,-7.55) 14(0.5,-7.55) 15(1,-7.55) 16(1.5,-7.55) 17(2,-7.55) 18(2.5,-7.55) 19(3,-7.55) 20(3.5,-7.55) 21(4,-7.55) 22(4.5,-7.55) 23(5,-7.55) 24(5.5,-7.55) 25(6,-7.55) 51(6,7.55) 52(5.5,7.55) 53(5,7.55) 54(4.5,7.55) 55(4,7.55) 56(3.5,7.55) 57(3,7.55) 58(2.5,7.55) 59(2,7.55) 60(1.5,7.55) 61(1,7.55) 62(0.5,7.55) 63(0,7.55) 64(-0.5,7.55) 65(-1,7.55) 66(-1.5,7.55) 67(-2,7.55) 68(-2.5,7.55) 69(-3,7.55) 70(-3.5,7.55) 71(-4,7.55) 72(-4.5,7.55) 73(-5,7.55) 74(-5.5,7.55) 75(-6,7.55)
  oval 1.6x0.3 smd: 26(7.55,-6) 27(7.55,-5.5) 28(7.55,-5) 29(7.55,-4.5) 30(7.55,-4) 31(7.55,-3.5) 32(7.55,-3) 33(7.55,-2.5) 34(7.55,-2) 35(7.55,-1.5) 36(7.55,-1) 37(7.55,-0.5) 38(7.55,0) 39(7.55,0.5) 40(7.55,1) 41(7.55,1.5) 42(7.55,2) 43(7.55,2.5) 44(7.55,3) 45(7.55,3.5) 46(7.55,4) 47(7.55,4.5) 48(7.55,5) 49(7.55,5.5) 50(7.55,6) 76(-7.55,6) 77(-7.55,5.5) 78(-7.55,5) 79(-7.55,4.5) 80(-7.55,4) 81(-7.55,3.5) 82(-7.55,3) 83(-7.55,2.5) 84(-7.55,2) 85(-7.55,1.5) 86(-7.55,1) 87(-7.55,0.5) 88(-7.55,0) 89(-7.55,-0.5) 90(-7.55,-1) 91(-7.55,-1.5) 92(-7.55,-2) 93(-7.55,-2.5) 94(-7.55,-3) 95(-7.55,-3.5) 96(-7.55,-4) 97(-7.55,-4.5) 98(-7.55,-5) 99(-7.55,-5.5) 100(-7.55,-6)
M3螺丝
  round 3.2 hole 3.2: 1(-0.064,0.064)
OSC-SMD_4P-L3.2-W2.5-BL
  rect 1.4x1.2 smd: 1(-1.1,-0.875) 2(1.1,-0.875) 3(1.1,0.875) 4(-1.1,0.875)
QFN-24_L4.0-W4.0-P0.50-BL-EP2.7
  oval 0.28x0.8 smd: 1(-1.25,-2) 2(-0.75,-2) 3(-0.25,-2) 4(0.25,-2) 5(0.75,-2) 6(1.25,-2) 13(1.25,2) 14(0.75,2) 15(0.25,2) 16(-0.25,2) 17(-0.75,2) 18(-1.242,2)
  oval 0.8x0.28 smd: 7(2,-1.25) 8(2,-0.75) 9(2,-0.25) 10(2,0.25) 11(2,0.75) 12(2,1.25) 19(-2,1.25) 20(-2,0.75) 21(-2,0.25) 22(-2,-0.25) 23(-2,-0.75) 24(-2,-1.25)
  rect 2.7x2.7 smd: 25(0.013,0)
R0603
  rect 0.806x0.864 smd: 1(-0.753,0) 2(0.753,0)
R0805
  rect 1.133x1.377 smd: 1(-1,0) 2(1,0)
SIM-SMD_C9900015645
  rect 0.7x1.6 smd: 1(2.25,5.3) 2(1.15,5.3) 3(0.05,5.3) 4(-1.05,5.3) 5(-2.15,5.3) 6(-3.25,5.3) 7(-4.35,5.3) 8(-5.45,5.3) 9(-6.55,5.3)
  rect 1.2x1.8 smd: 10(-7.75,4)
  rect 1.6x1.5 smd: 11(7.1,4.25)
  rect 1.2x2.2 smd: 12(-7.75,-5.3) 13(7.75,-5.3)
SOP-8_L4.9-W3.9-P1.27-LS6.0-BL
  oval 0.63x1.865 smd: 1(-1.905,-2.683) 2(-0.635,-2.683) 3(0.635,-2.683) 4(1.905,-2.683) 5(1.905,2.683) 6(0.635,2.683) 7(-0.635,2.683) 8(-1.905,2.683)
SW-SMD_MSK12CO2-BDM
  rect 0.6x1.3 smd: 1(2.25,1.525) 2(0.75,1.525) 3(-2.25,1.525)
  rect 1.15x0.7 smd: 4(-3.7,0.675) 4(-3.7,-1.525) 4(3.7,0.675) 4(3.7,-1.525)

## Nets
As in the schematic.

Pads without a net: FPC2 7 11 12; SCREW1 1; SCREW2 1; SCREW3 1; SCREW4 1; SW7 3 4; U1 9; U2 4; U10 1 2 3 4 5 6 7 12; U13 1; U17 8 9; U18 10 11; U22 4; U23 3; U25 2 3 4 5 6 7 12 14 15 16 17 19 21 22; U26 4; USB3 A8 B8

## Via types
v1: diameter 0.61, hole 0.305, Top Layer to Bottom Layer, 96 vias

## Routing (per net, layer and track width the routed paths; a pad name or vN(x,y) marks a point on that pad's centre or on a via; arc(x,y) is an arc through that point)
3.3V: length 333
  Top Layer w0.254: U17.21 22.92,27.18 ; 22.92,27.18 v1(22.61,26.86) 22.54,26.92 22.1,26.92 21.92,27.1 U17.19 ; 22.92,27.18 23.42,27.68 U17.22 23.42,31.55 23.7,31.83 U17.28 ; v1(10.29,22.34) 10.16,22.47 10.16,30.61 10.38,30.83 U17.100 ; v1(38.86,20.32) 40.63,20.32 R42.2 ; v1(19.11,17.65) 18.73,18.03 14.8,18.03 C23.2 ; FPC2.9 FPC2.8 20.05,10.52 20.19,10.67 v1(20.83,10.67) ; C43.2 v1(25.15,26.86) ; v1(12.92,45.97) U17.75 12.92,42.96 v1(13.21,42.67) ; C42.2 26.92,43.28 U17.50 ; U17.11 17.92,27.96 16.76,26.8 v1(16.38,26.8) 15.42,27.76 U17.6
  Top Layer w0.381: U25.13 11.54,14.75 v1(11.81,14.48) ; v1(13.46,14.44) 13.46,14.48 ; R7.2 R53.2 R52.2 1.41,21.48 R6.2 1.4,16.89 v1(6.48,11.81) C26.2 7.75,11.62 U25.8 ; v1(19.11,17.65) 19.05,17.65
  Top Layer w0.508: v1(38.61,56.26) 38.62,56.28 U26.5 40.39,57.91 41.15,58.67 41.15,61.73 ; C58.1 C57.1 26.73,18.36 27.56,19.18 v1(27.56,20.07) ; 41.15,61.73 41.15,63.95 C53.2 ; 41.15,61.73 41.14,61.72 U26.8 36.96,61.72 36.07,62.61 34.03,62.61 33.46,63.18 C54.2 ; U18.1 4.47,60.3 4.44,60.33 3.94,59.82 3.94,56.9 6.73,54.1 C2.2 C1.2 8.44,51.49 10.12,49.82 U2.5 10.92,48.66 v1(10.92,48.51)
  Top Layer w0.635: v1(31.88,28.45) U24.1 33.91,28.45 35.94,30.48 35.94,33.8 U23.1 38,40.29 v1(38.1,40.39) ; C42.2 C45.2 24.89,48.64 v1(25.02,48.51) ; R48.2 11.94,24.89 12.7,25.65 15.94,25.65 C44.2 16.38,26.1 v1(16.38,26.8)
  Inner2 w0.254: v1(31.88,28.45) 37.97,28.45 38.86,27.56 v1(38.86,20.32) ; v1(10.92,48.51) 12.92,46.51 v1(12.92,45.97)
  Inner2 w0.381: v1(13.46,14.44) 13.43,14.48 v1(11.81,14.48) 9.14,11.81 v1(6.48,11.81)
  Inner2 w0.508: v1(25.02,48.51) 25.02,52.7 28.57,56.26 v1(38.61,56.26) ; v1(27.56,20.07) 25.71,18.21 19.67,18.21 ; v1(10.92,48.51) 8.25,45.85 1.91,45.85 0.76,44.7 0.76,12.83 1.78,11.81 v1(6.48,11.81) ; v1(10.29,22.34) 12.95,19.68 12.95,16.64 11.81,15.49 v1(11.81,14.48)
  Inner2 w0.635: v1(19.11,17.65) 22.61,21.15 v1(22.61,26.86) ; v1(31.88,28.45) 30.23,26.8 25.21,26.8 v1(25.15,26.86) v1(22.61,26.86) ; v1(16.38,26.8) 22.54,26.8 v1(22.61,26.86) ; v1(38.1,40.39) 38.1,46.74 36.32,48.51 v1(25.02,48.51) v1(10.92,48.51)
  Bottom Layer w0.254: v1(20.83,10.67) R3.1 ; v1(12.92,45.97) 12.95,45.97
  Bottom Layer w0.381: U1.4 v1(13.46,14.44) ; R5.1 20.94,8.62 R4.1 20.83,8.73 v1(20.83,10.67) 20.94,10.78 R51.1 R50.1 19.11,16.56 C52.1 v1(19.11,17.65)
3.7V: length 76.1
  Top Layer w0.635: U2.3 7.81,47.46 C11.2 ; U13.2 5.45,38.49 v1(5.46,38.48) 5.46,35.05 4.57,34.16 2.05,34.16 1.41,33.53 R55.2 ; U2.1 6.22,49.46 5.59,48.83 5.59,46.61 6.35,45.85 C11.2 ; v1(7.75,44.2) 7.81,44.26 C11.2
  Inner2 w0.635: v1(7.75,44.2) 7.75,40.77 v1(5.46,38.48) 9.91,38.48 12.19,36.2 21.72,36.2 24.64,39.12 v1(40.64,39.12)
  Bottom Layer w0.635: v1(40.64,39.12) 40.64,37.34 ; 40.64,37.34 C22.2 40.62,36.15 U22.3 ; 40.64,37.34 40.13,37.85 37.21,37.85 36.9,37.53 U22.1
5V: length 65.7
  Top Layer w0.254: 19.25,55.12 19.26,55.12 22.23,55.12 ; 19.25,55.12 19.25,62.42 R12.2 ; 19.25,55.12 19.25,53.09 ; 22.23,55.12 22.72,55.62 22.72,57.41 ; 22.23,55.12 27.05,55.12 27.52,55.59 USB3.B9
  Top Layer w0.508: U21.8 v1(15.11,64.64) ; R12.2 17.64,61.72 v1(17.53,61.72)
  Top Layer w0.635: 19.25,58.08 19.21,58.04 v1(17.78,58.04) ; C14.1 8.38,59.82 v1(7.62,59.82) 7.62,60.69 U21.4
  Inner2 w0.508: v1(15.11,64.64) 15.11,62.23 15.62,61.72 v1(17.53,61.72)
  Bottom Layer w0.635: v1(17.78,58.04) 16,59.82 v1(7.62,59.82) 4.57,56.77 4.57,43.42 R57.2
GND: length 83.3
  Top Layer w0.254: U25.25 9.16,15.32 v1(9.19,15.32) ; U25.25 8.5,15.99 v1(9.19,16.68) ; U25.25 7.91,15.41 v1(7.91,15.32) ; U25.25 8.5,16.1 v1(7.91,16.68) 7.34,17.25 U25.1 v1(5.08,17.25) ; U17.20 v1(22.42,31.24) ; v1(11.68,12.06) 10.16,12.06 9.25,12.98 U25.11 ; U21.9 10.03,62.1 v1(7.76,62.1) ; v1(21.84,17.15) 21.82,17.17 21.82,18.29 ; U17.99 v1(9.78,31.33) ; v1(13.84,24) C49.2 15.62,22.29 C48.1 16.07,21.15 15.62,20.7 15.62,19.05 16.13,18.54 21.56,18.54 21.82,18.29 ; 22.22,57.41 USB3.A12 21.92,57.59 USB3.2 ; U17.10 17.42,28.35 16.76,27.69 v1(16.38,27.69) ; U18.8 7.15,56.8 C2.1 C1.1 10.67,52.2 ; C11.1 10.29,45.85 ; USB3.1 29.59,58.38 USB3.A1 USB3.B12 ; U25.18 10.54,17.29 v1(10.54,18.29) ; U17.74 13.42,43.47 14.35,42.55 v1(14.48,42.55) ; 21.82,18.29 24,18.29 24.64,18.92 C47.1 24.46,19.57 X3.4 21.48,19.57 19.73,21.32 ; U17.27 25.23,31.33 24.89,30.99 24.89,30.73 25.65,29.97 v1(25.65,29.84) ; v1(37.34,14.86) 39.72,14.86 CN1.5 41.53,16.67 C3.1 ; 5.84,56.64 v1(6.99,55.5)
  Inner1 w0.254: v1(4.35,20.19) 5.08,19.47 v1(5.08,17.25)
  Bottom Layer w0.254: v1(22.42,31.24) 22.35,31.24 ; U1.13 v1(4.35,20.19) ; R56.1 v1(9.14,42.66) ; v1(13.84,24) 13.9,23.94 U1.11 ; C52.2 21.46,16.76 v1(21.84,17.15)
  vias: v1(9.91,63.88) v1(9.91,61.72) v1(11.37,63.88) v1(11.43,61.59) v1(13.21,49.47) v1(17.59,59.82) v1(41.59,23.11)
VIN: length 34.2
  Top Layer w0.508: v1(16.26,60.71) 16.26,59.88 C15.2 ; v1(13.21,61.34) 13.58,60.97 U21.5
  Top Layer w0.635: U13.3 3.81,47.12 3.56,47.37 H1.1
  Inner1 w0.508: v1(13.9,61.34) v1(13.21,61.34)
  Inner2 w0.508: v1(13.9,61.34) 13.9,60.91 14.1,60.71 v1(16.26,60.71)
  Inner2 w0.635: H1.1 6.6,47.37 13.21,53.98 v1(13.21,61.34)
LEDK: length 4.5
  Top Layer w0.254: FPC2.10 21.05,8.16 21.72,7.49 23.97,7.49 U27.3
OSCIN: length 13.3
  Top Layer w0.254: 18.4,19.57 18.03,19.94 18.03,22.99 18.54,23.5 R43.2 18.42,24 U17.12 ; 18.4,19.57 X3.3 ; 18.4,19.57 16.94,19.57 C48.2
OSCOUT: length 12.2
  Top Layer w0.254: U17.13 18.92,25.01 R43.1 21.55,22.39 X3.1 24.46,21.32 C47.2
OUT_D: length 39.3
  Top Layer w0.254: v1(7.58,27.94) 7.58,25.91 LED5.2 LED2.2 LED12.2
  Top Layer w0.508: v1(32.38,36.2) 32.88,36.2 U7.3
  Inner1 w0.508: v1(32.38,36.2) 32,36.2 31.37,35.56 31.37,34.8 31.12,34.54 8.38,34.54 7.49,33.66 7.49,28.03 v1(7.58,27.94)
PA0: length 36.4
  Top Layer w0.254: SW1.3 35.9,46.36 32.26,46.36 31.37,45.47 v1(31.37,32.51) ; U17.23 23.92,24.97 24.38,24.51 v1(27.05,24.51)
  Bottom Layer w0.254: v1(27.05,24.51) 27.05,30.1 29.46,32.51 v1(31.37,32.51)
PA1: length 13.9
  Top Layer w0.254: v1(32.13,29.84) 32.13,30.97 R15.2 32.2,31.04 U7.1 ; U17.24 24.42,28.16 24.76,27.81 v1(27.81,27.81)
  Bottom Layer w0.254: v1(27.81,27.81) 30.1,27.81 v1(32.13,29.84)
PA2: length 9
  Top Layer w0.254: R47.1 v1(30.62,29.21) ; v1(27.81,29.21) 24.99,29.21 U17.25
  Bottom Layer w0.254: v1(30.62,29.21) v1(27.81,29.21)
PA3: length 25.6
  Top Layer w0.254: SW1.2 31.88,48.9 30.86,47.88 30.86,34.54 v1(29.46,33.15) ; U17.26 v1(26.47,30.23)
  Bottom Layer w0.254: v1(29.46,33.15) 29.39,33.15 v1(26.47,30.23)
PA4: length 17
  Top Layer w0.254: U17.29 28.07,32.33 28.45,31.95 28.45,22.99 29.21,22.23 31.73,22.23 R2.2
PA5: length 21.2
  Top Layer w0.254: U17.30 28.13,32.83 28.96,32 28.96,23.5 29.59,22.86 35.3,22.86 R1.2
PA6: length 25.8
  Top Layer w0.254: U17.31 28.76,33.33 30.48,35.05 30.48,50.17 31.75,51.44 35.9,51.44 SW1.1
PA11: length 49
  Top Layer w0.254: U27.1 26.92,6.6 27.94,7.62 27.94,12.57 27.32,13.19 R58.2 25.64,13.84 v1(22.86,13.84) ; U17.70 15.42,42.49 16.38,41.53 16.38,33.4 16.64,33.15 v1(20.96,33.15)
  Bottom Layer w0.254: v1(22.86,13.84) 22.86,23.75 20.96,25.65 v1(20.96,33.15)
PB0: length 12.2
  Top Layer w0.254: v1(32.13,35.31) 32.51,34.92 34.16,34.92 35.31,36.07 35.31,38.73 LED11.2 ; U17.35 v1(29.72,35.33)
  Bottom Layer w0.254: v1(29.72,35.33) 29.72,35.31 v1(32.13,35.31)
PB1: length 26.7
  Top Layer w0.254: v1(13.34,32.26) 21.21,32.26 24.78,35.83 U17.36 ; R54.2 R55.1 v1(8.25,32.26)
  Bottom Layer w0.254: v1(8.25,32.26) v1(13.34,32.26)
PB8: length 20.9
  Top Layer w0.254: U17.95 12.45,33.33 12.7,33.08 12.7,30.73 11.23,29.26 11.23,21.55 R48.1 11.04,19.94 8.13,19.94 7.75,19.56 U25.23
PB9: length 19.9
  Top Layer w0.254: 9.64,20.84 8.01,20.84 7.25,20.07 U25.24 ; 9.64,20.84 8.89,21.59 8.89,32.26 9.46,32.83 U17.96 ; 9.64,20.84 R10.1
PB10: length 25.2
  Top Layer w0.254: U17.47 28.77,41.33 v1(29.08,41.02)
  Bottom Layer w0.254: v1(29.08,41.02) 29.08,42.04 29.46,42.42 33.15,42.42 34.29,41.28 34.29,28.42 U10.11
PB11: length 21.8
  Top Layer w0.254: U17.48 29.8,41.83 v1(29.84,41.78)
  Bottom Layer w0.254: U10.10 33.76,40.28 32.26,41.78 v1(29.84,41.78)
PB13: length 47.3
  Top Layer w0.254: FPC2.3 17.53,9.31 17.53,7.62 18.92,6.22 v1(23.88,6.22) ; U17.52 v1(24.42,36.7)
  Bottom Layer w0.254: v1(24.42,36.7) 24.38,36.7 24.38,23.62 23.62,22.86 23.62,14.73 23.88,14.48 v1(23.88,6.22)
PB15: length 44.2
  Top Layer w0.254: FPC2.6 19.05,9.33 19.05,7.37 19.56,6.86 v1(22.86,6.86) ; U17.54 v1(23.42,35.81)
  Bottom Layer w0.254: v1(23.42,35.81) 23.42,24.89 23.24,24.71 23.24,14.48 23.5,14.22 23.5,7.11 23.24,6.86 v1(22.86,6.86)
PC0: length 25.3
  Top Layer w0.254: U17.15 v1(19.92,31.5)
  Bottom Layer w0.254: R57.1 R56.2 18.78,40.66 19.92,39.51 v1(19.92,31.5)
PC1: length 26.5
  Top Layer w0.254: FPC2.2 17.05,10.7 25.53,19.18 25.53,22.35 25.02,22.86 23.37,22.86 20.42,25.81 U17.16
PC2: length 26.2
  Top Layer w0.254: U17.17 20.92,25.81 23.5,23.24 25.15,23.24 25.91,22.48 25.91,19.05 18.05,11.19 FPC2.4
PC3: length 26.2
  Top Layer w0.254: U17.18 21.42,25.82 23.62,23.62 25.4,23.62 26.29,22.73 26.29,18.8 18.55,11.05 FPC2.5
PC8: length 40.5
  Top Layer w0.254: U17.65 17.92,39.51 v1(17.91,39.5) ; v1(17.27,11.81) 17.91,12.45 v1(17.91,17.27)
  Bottom Layer w0.254: 16.51,11.05 R4.2 ; 16.51,11.05 15.05,11.05 U1.7 16.41,11.14 16.51,11.05 ; 16.51,11.05 v1(17.27,11.81) ; v1(17.91,17.27) v1(17.91,39.5)
PC9: length 44.8
  Top Layer w0.254: U17.66 17.42,40.16 17.02,39.75 v1(17.02,38.86) ; v1(13.46,10.54) 16.26,10.54 16.51,10.8 16.51,16.89 v1(17.02,17.4)
  Bottom Layer w0.254: v1(17.02,17.4) v1(17.02,38.86) ; R5.2 18.29,6.6 17.78,7.11 17.78,8.14 15.88,10.04 U1.8 13.96,10.04 v1(13.46,10.54)
PC10: length 33.7
  Top Layer w0.254: v1(15.75,40.01) 15.75,41.28 15.19,41.83 U17.78
  Bottom Layer w0.254: v1(15.75,40.01) 15.75,18.54 U1.1 15.66,17.74 18.67,14.73 R50.2
PC11: length 36.4
  Top Layer w0.254: v1(14.99,39.75) 14.99,40.89 14.55,41.33 U17.79
  Bottom Layer w0.254: v1(14.99,39.75) 15.24,39.5 15.24,19.81 13.46,18.03 13.46,17.27 14.09,16.64 U1.2 15.88,16.64 17.78,14.74 17.78,13.46 18.54,12.7 R51.2
PC12: length 33.2
  Top Layer w0.254: U17.80 14.03,40.83 14.35,40.51 v1(14.35,38.99)
  Bottom Layer w0.254: U1.5 13.33,13.34 12.57,14.1 12.57,24.13 14.6,26.16 14.6,38.73 v1(14.35,38.99)
PD2: length 36.7
  Top Layer w0.254: U17.83 12.99,39.33 13.97,38.35 v1(13.97,37.72) ; v1(11.94,18.03) 11.94,15.75 12.19,15.49 v1(13.34,15.49)
  Bottom Layer w0.254: v1(13.97,37.72) 13.97,26.16 11.94,24.13 v1(11.94,18.03) ; v1(13.34,15.49) 13.38,15.54 U1.3 15.88,15.54 17.27,14.15 17.27,12.7 18.94,11.03 R3.2
RESET: length 30.2
  Top Layer w0.254: U17.14 19.42,25.92 23.11,22.23 v1(24.51,22.23) ; SW7.2 40.19,24.75 C46.2 40.19,21.39 R42.1 39.25,22.23 v1(37.34,22.23)
  Bottom Layer w0.254: v1(24.51,22.23) v1(37.34,22.23)
SWCLK: length 18.7
  Top Layer w0.254: U18.5 6.98,58.3 11.56,53.72 11.56,43.01 U17.76
SWDIO: length 18.9
  Top Layer w0.254: U18.4 7.12,58.8 11.94,53.98 11.94,52.65 14.42,50.17 U17.72
USART1_RX: length 37.7
  Top Layer w0.254: U26.6 39.75,59.18 40.13,59.56 40.13,60.96 40,61.09 36.32,61.09 34.8,59.56 34.8,57.53 31.88,54.61 22.35,54.61 15.92,48.18 U17.69
USART1_TX: length 32.2
  Top Layer w0.254: U26.7 36.32,60.45 35.18,59.31 35.18,57.4 32,54.23 22.48,54.23 16.42,48.17 U17.68
USB_D+: length 16.3
  Top Layer w0.254: U26.1 31.62,61.72 30.99,61.09 25.02,61.09 24.52,60.59 USB3.B6 24.52,56 24.67,55.85 25.37,55.85 25.52,56 USB3.A6
USB_D-: length 13.4
  Top Layer w0.254: 26.02,59.94 USB3.B7 ; 26.02,59.94 26.02,60.06 26.42,60.45 U26.2 ; 26.02,59.94 25.27,59.94 25.02,59.69 USB3.A7
WF3.3V: length 25.2
  Bottom Layer w0.635: U22.5 37.78,33.07 37.78,30.42 ; 37.78,30.42 C20.2 ; 37.78,30.42 C21.2 ; 37.78,30.42 37.59,30.23 37.59,24.26 37.08,23.75 29.34,23.75 28.76,24.32 U10.8
$1N8081: length 6
  Top Layer w0.254: U17.94 7.11,33.83 6.73,34.21 R40.1
$1N8083: length 5
  Top Layer w0.254: C40.2 29.08,42.8 28.61,42.33 U17.49
$1N8084: length 4
  Top Layer w0.254: U17.73 13.92,47.35 C41.2
$1N8487: length 2.3
  Top Layer w0.254: LED11.1 36.95,38.77 R41.1
$1N9627: length 5.3
  Top Layer w0.254: USB3.B5 v1(23.52,61.21)
  Bottom Layer w0.254: R45.1 23.52,62.46 v1(23.52,61.21)
$1N9629: length 5.6
  Top Layer w0.254: USB3.A5 26.52,59.16 v1(27.05,59.69)
  Bottom Layer w0.254: R44.2 27.05,62.24 v1(27.05,59.69)
$1N11460: length 1.7
  Top Layer w0.254: R12.1 17.28,64.38 LED3.1
$1N11750: length 9.6
  Top Layer w0.254: U21.7 14.35,63.37 14.73,62.99 14.73,56.12 R29.2
$1N11751: length 10.7
  Top Layer w0.254: v1(12.32,54.99) 12.32,54.23 13.46,53.09 R30.2 ; v1(12.32,58.93) 12.32,61.57 12.85,62.1 U21.6
  Bottom Layer w0.254: v1(12.32,58.93) v1(12.32,54.99)
$1N11752: length 1.9
  Top Layer w0.254: R29.1 LED9.1
$1N11753: length 1.9
  Top Layer w0.254: R30.1 LED10.1
$1N11757: length 13.6
  Top Layer w0.254: R31.1 12.48,55.88 10.54,55.88 6.73,59.69 6.73,62.99 7.11,63.37 U21.2
$1N13842: length 8.1
  Top Layer w0.254: Q3.3 36.18,28.43 U24.2 36.83,28.45 38,29.62 U23.2
$1N13844: length 3.7
  Top Layer w0.254: R46.2 R47.2 34.12,25.91 Q3.1
$1N14203: length 6.1
  Top Layer w0.254: U25.20 9.25,18.53 10.15,19.43 12.38,19.43 C49.1
$1N14204: length 4.1
  Top Layer w0.254: U25.10 8.75,11.83 9.91,10.67 C25.2
$1N14208: length 3.6
  Top Layer w0.254: U25.9 8.25,10.41 R49.2
$1N15753: length 12.3
  Top Layer w0.254: C50.1 35.56,16.89 35.56,9.81 CN1.3
$1N15754: length 11.6
  Top Layer w0.254: C51.1 33.34,15.48 CN1.2 31.22,13.36 CN1.4
$1N15756: length 7.7
  Top Layer w0.254: 36.08,18.8 C50.2 ; 36.08,18.8 36.96,19.69 41.34,19.69 C3.2 ; 36.08,18.8 R1.1
$1N15757: length 4
  Top Layer w0.254: 31.81,20.51 31.94,20.39 C51.2 ; 31.81,20.51 C4.2 ; 31.81,20.51 R2.1
$1N16357: length 2.3
  Top Layer w0.254: LED2.1 R52.1
$1N16358: length 2.5
  Top Layer w0.254: R6.1 5.5,21.46 LED12.1
$1N16359: length 2.5
  Top Layer w0.254: LED4.1 R7.1
$1N16360: length 2.3
  Top Layer w0.254: R53.1 LED5.1

## Copper pours and planes (outline as drawn; the poured copper is in the pictures)
3.3V on Top Layer: 5.08,60.45 6.35,60.45 6.35,59.18 5.08,59.18
3.3V on Inner2: -15.49,83.69 51.56,83.69 51.56,-10.29 -15.49,-10.29
5V on Top Layer: 18.4,63.63 23.11,63.63 23.11,55.23 18.4,55.23
5V on Top Layer: 23.11,58.55 27.94,58.55 27.94,55.23 23.11,55.23
GND on Top Layer: -5.98,75.06 49.02,75.06 49.02,-2.79 -5.98,-2.79
GND on Top Layer: 5.04,57.8 6.35,57.8 6.35,56.52 5.04,56.52
GND on Bottom Layer: -14.48,80.01 56.01,80.01 56.01,-7.87 -14.48,-7.87
GND on Inner1: -8.25,75.06 47.88,75.06 47.88,-2.03 -8.25,-2.03
